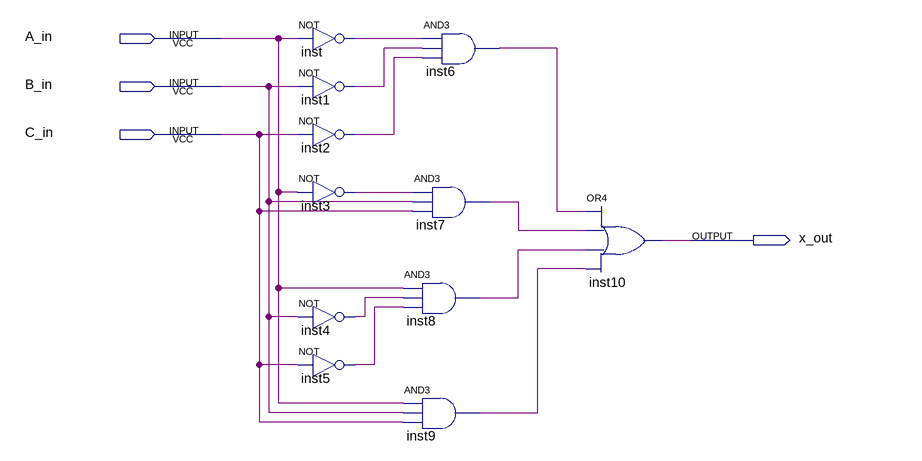
[diagram p0: schematic sheet]
// Quartus schematic diagrama_logico.bdf as structural Verilog: 11 symbols, 4 pins
module diagrama_logico (
  input  A_in,
  input  B_in,
  input  C_in,
  output x_out
);

  wire inst1_out, inst2_out, inst3_out, inst4_out, inst5_out, inst6_out, inst7_out, inst8_out, inst9_out,
       inst_out;

  not inst (inst_out, A_in);
  not inst1 (inst1_out, B_in);
  not inst2 (inst2_out, C_in);
  not inst3 (inst3_out, A_in);
  not inst4 (inst4_out, B_in);
  not inst5 (inst5_out, C_in);
  and inst6 (inst6_out, inst_out, inst1_out, inst2_out);
  and inst7 (inst7_out, inst3_out, B_in, C_in);
  and inst8 (inst8_out, A_in, inst4_out, inst5_out);
  and inst9 (inst9_out, A_in, B_in, C_in);
  or inst10 (x_out, inst6_out, inst7_out, inst8_out, inst9_out);
endmodule
